# Altium schematic sheet esp32_weather_station_schematic_main.SchDoc: ESP32 weather station
size A; Author: Krzysztof Sikora; DrawnBy: Krzysztof Sikora; Engineer: Krzysztof Sikora; Organization: KNE; DocumentNumber: 1; Revision: 1.0; SheetNumber: 1; SheetTotal: 1
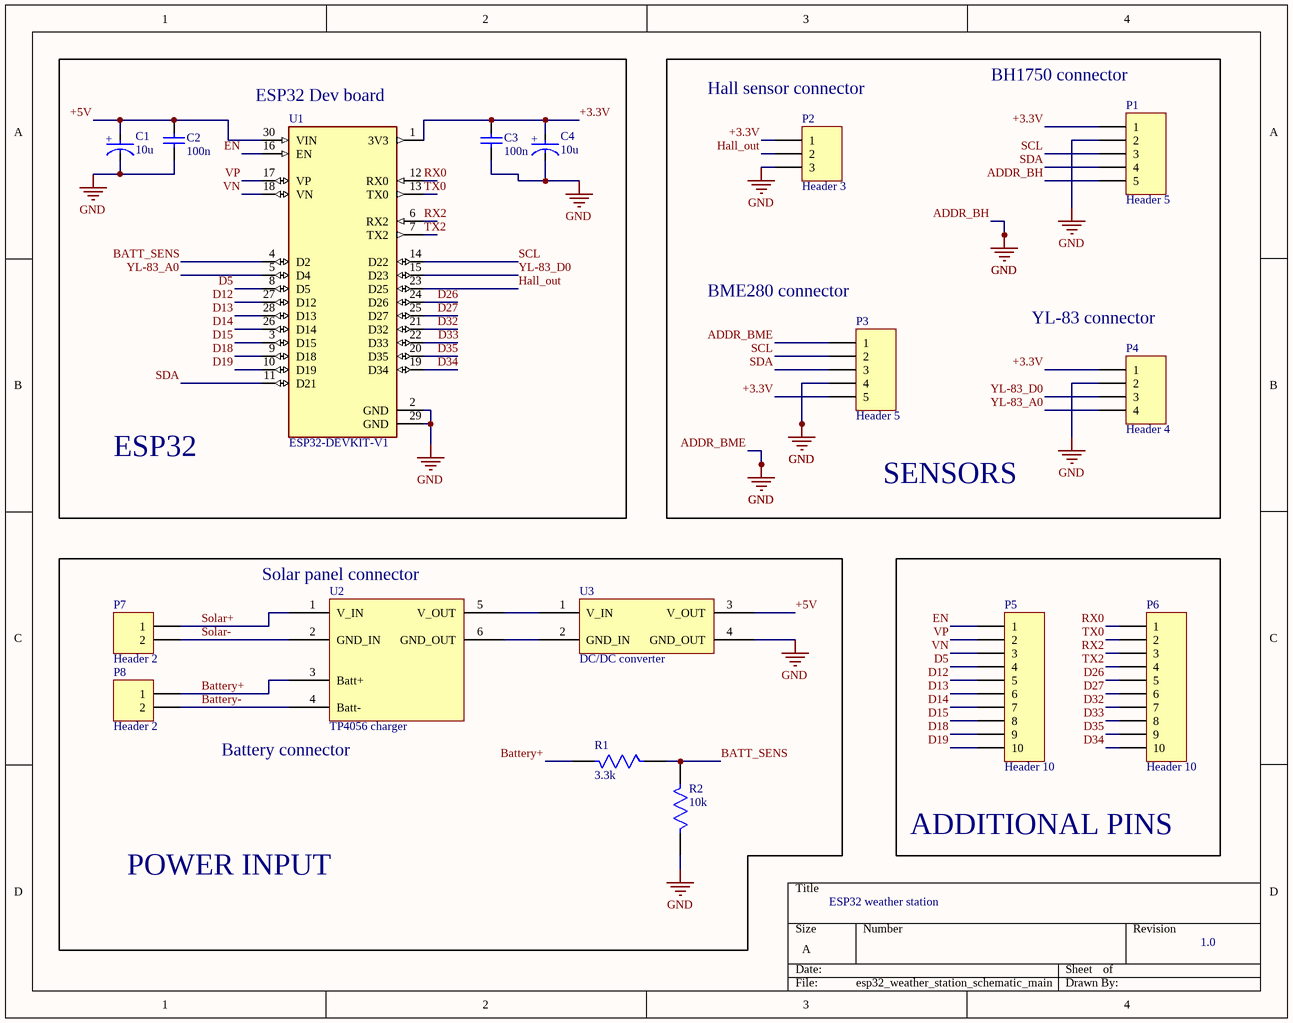
[diagram p0: esp32_weather_station_schematic_main.SchDoc]

## Parts
C1  10u  [FP-RAD-TH-D_5_0_5-L_11_1-MFG]
C2  100n  [CAPC2013X140X50NL20T25]
C3  100n  [CAPC2013X140X50NL20T25]
C4  10u  [FP-RAD-TH-D_5_0_5-L_11_1-MFG]
P1  Header 5  [HDR1X5]
P2  Header 3  [HDR1X3]
P3  Header 5  [HDR1X5]
P4  Header 4  [HDR1X4]
P5  Header 10  [HDR1X10]
P6  Header 10  [HDR1X10]
P7  Header 2  [HDR1X2]
P8  Header 2  [18650 holder]
R1  3.3k  [FP-CRCW1206-e3-IPC_C]
R2  10k  [FP-CRCW1206-e3-IPC_C]
U1  ESP32-DEVKIT-V1  [MODULE_ESP32_DEVKIT_V1]
U2  TP4056 charger  [TP4056 module]
U3  DC/DC converter  [DC/DC converter module]

## Blocks framed on the sheet
ESP32: C1-C4 U1
SENSORS: P1-P4
POWER INPUT: P7 P8 R1 R2 U2 U3
ADDITIONAL PINS: P5 P6

## Nets
ADDR_BH: C1.1(C) C2.1 C3.1 C4.1(C) P1.2 P1.5 P2.3 P3.1 P3.4 P4.2 R2.1 U1.2(GND) U1.29(GND) U3.4(GND_OUT)  [also labelled ADDR_BME, GND]
+3.3V: C3.2 C4.2(A) P1.1 P2.1 P3.5 P4.1 U1.1(3V3)
+5V: C1.2(A) C2.2 U1.30(VIN) U3.3(V_OUT)
BATT_SENS: R1.1 R2.2 U1.4(D2)
Battery+: P8.1 R1.2 U2.3(Batt+)
Battery-: P8.2 U2.4(Batt-)
D5: P5.4 U1.8(D5)
D12: P5.5 U1.27(D12)
D13: P5.6 U1.28(D13)
D14: P5.7 U1.26(D14)
D15: P5.8 U1.3(D15)
D18: P5.9 U1.9(D18)
D19: P5.10 U1.10(D19)
D26: P6.5 U1.24(D26)
D27: P6.6 U1.25(D27)
D32: P6.7 U1.21(D32)
D33: P6.8 U1.22(D33)
D34: P6.10 U1.19(D34)
D35: P6.9 U1.20(D35)
EN: P5.1 U1.16(EN)
Hall_out: P2.2 U1.23(D25)
RX0: P6.1 U1.12(RX0)
RX2: P6.3 U1.6(RX2)
SCL: P1.3 P3.2 U1.14(D22)
SDA: P1.4 P3.3 U1.11(D21)
Solar+: P7.1 U2.1(V_IN)
Solar-: P7.2 U2.2(GND_IN)
TX0: P6.2 U1.13(TX0)
TX2: P6.4 U1.7(TX2)
VN: P5.3 U1.18(VN)
VP: P5.2 U1.17(VP)
YL-83_A0: P4.4 U1.5(D4)
YL-83_D0: P4.3 U1.15(D23)
NetU2_5: U2.5(V_OUT) U3.1(V_IN)
NetU2_6: U2.6(GND_OUT) U3.2(GND_IN)

## Notes on the sheet
- (near U1) ESP32 Dev board
- (near P2) Hall sensor connector
- (near P1) BH1750 connector
- (near P3) BME280 connector
- (near P4) YL-83 connector
- (near P7) Solar panel connector
- (near P8) Battery connector
- (in symbol CMP-05427-000247-1) +

## Library data of the parts
C1 C4 = CMP-05427-000247-1: electrolytic tht 10uF; Voltage Rating (DC): 50V; Ripple Current (AC): 26mA; Lead Diameter: 0.5mm; Tolerance: 20%; Lead/Base Style: Straight; Polarity: Polar; Capacitance: 4.7uF; Life (Hours): 1000Hour; Length: 11mm; Packaging: Bulk; Min Operating Temperature: -55°C; RoHS Compliant: Yes; REACH SVHC: No SVHC; Lead Pitch: 2.5mm; Package Quantity: 200; Lead Free: Lead Free; Termination: Radial; Voltage: 50V; Construction: RADIAL; Mount: Through Hole; Diameter: 5mm; Ripple Current: 26mA; Voltage Rating: 50V; Height - Seated (Max): 0.492inch; Number of Pins: 2; Max Operating Temperature: 105°C; Height: 11mm; Case/Package: Radial; Series: HD
C2 C3 = CMP-2007-04629-1: 0805 ceramic; Part Number: 08055C104K4Z2A; Manufacturer: AVX Interconnect / Elco
P1 P3 = Header 5: Header, 5-Pin; LatestRevisionDate: 17-Jul-2002; LatestRevisionNote: Re-released for DXP Platform.; Publisher: Altium Limited
P2 = Header 3: Header, 3-Pin; LatestRevisionDate: 17-Jul-2002; LatestRevisionNote: Re-released for DXP Platform.; Publisher: Altium Limited
P4 = Header 4: Header, 4-Pin; LatestRevisionDate: 17-Jul-2002; LatestRevisionNote: Re-released for DXP Platform.; Publisher: Altium Limited
P5 P6 = Header 10: Header, 10-Pin; LatestRevisionDate: 17-Jul-2002; LatestRevisionNote: Re-released for DXP Platform.; Publisher: Altium Limited
P7 P8 = Header 2: Header, 2-Pin; LatestRevisionDate: 17-Jul-2002; LatestRevisionNote: Re-released for DXP Platform.; Publisher: Altium Limited
R1 R2 = CMP-2003-04857-2: Resistance: 0mR; Power Rating: 250mW; Temperature Coefficient: 100ppm/°C; Tolerance: 1%; Voltage Rating (DC): 200V; Width: 1.6mm; Termination: SMD/SMT; Contact Plating: Tin; Min Operating Temperature: -55°C; Military Standard: Not; Mount: Surface Mount; Case Code (Metric): 3216; Case Code (Imperial): 1206; Packaging: Tape and Reel; Depth: 1.6mm; Case/Package: 1206; Radiation Hardening: No; Height: 0.55mm; Package Quantity: 5000; Weight: 0.000353oz; Max Operating Temperature: 155°C; Length: 3.2mm; Composition: Thick Film; Lead Free: Lead Free; Voltage Rating: 200V
U1 = ESP32-DEVKIT-V1: Dual core, Wi-Fi: 2.4 GHz up to 150 Mbits/s,BLE (Bluetooth Low Energy) and legacy Bluetooth, 32 bits, Up to 240 MHz; MF: Do it; Price: None; Availability: Not in stock; Package: None; MP: ESP32-DEVKIT-V1; Value: *; SnapEDA_Link: https://www.snapeda.com/parts/ESP32-DEVKIT-V1/Do+it/view-part/?ref=snap; Check_prices: https://www.snapeda.com/parts/ESP32-DEVKIT-V1/Do+it/view-part/?ref=eda
U3 = DC/DC converter: SX1308 module